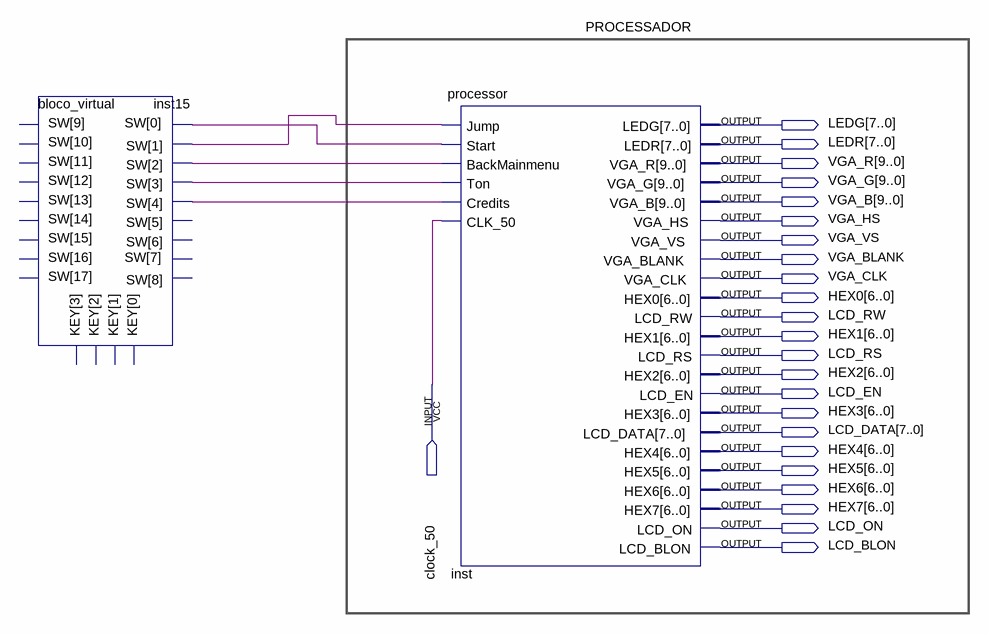
[diagram p0: schematic sheet]
// Quartus schematic projeto.bdf as structural Verilog: 2 symbols, 24 pins
module projeto (
  input  clock_50,
  output [7:0] LEDG,
  output [7:0] LEDR,
  output [9:0] VGA_R,
  output [9:0] VGA_G,
  output [9:0] VGA_B,
  output VGA_HS,
  output VGA_VS,
  output VGA_BLANK,
  output VGA_CLK,
  output [6:0] HEX0,
  output LCD_RW,
  output [6:0] HEX1,
  output LCD_RS,
  output [6:0] HEX2,
  output LCD_EN,
  output [6:0] HEX3,
  output [7:0] LCD_DATA,
  output [6:0] HEX4,
  output [6:0] HEX5,
  output [6:0] HEX6,
  output [6:0] HEX7,
  output LCD_ON,
  output LCD_BLON
);

  wire inst15_sw, inst15_sw_2, inst15_sw_3, inst15_sw_4, inst15_sw_5;
  wire [17:0] inst15_sw_open;  // unused outputs

  bloco_virtual inst15 (.SW({inst15_sw_open[17:5], inst15_sw_3, inst15_sw_2, inst15_sw, inst15_sw_5, inst15_sw_4}));  // open: KEY
  processor inst (
    .Jump(inst15_sw_5), .Start(inst15_sw_4), .BackMainmenu(inst15_sw), .Ton(inst15_sw_2),
    .Credits(inst15_sw_3), .CLK_50(clock_50), .LEDG(LEDG), .LEDR(LEDR), .VGA_R(VGA_R), .VGA_G(VGA_G),
    .VGA_B(VGA_B), .VGA_HS(VGA_HS), .VGA_VS(VGA_VS), .VGA_BLANK(VGA_BLANK), .VGA_CLK(VGA_CLK), .HEX0(HEX0),
    .LCD_RW(LCD_RW), .HEX1(HEX1), .LCD_RS(LCD_RS), .HEX2(HEX2), .LCD_EN(LCD_EN), .HEX3(HEX3),
    .LCD_DATA(LCD_DATA), .HEX4(HEX4), .HEX5(HEX5), .HEX6(HEX6), .HEX7(HEX7), .LCD_ON(LCD_ON),
    .LCD_BLON(LCD_BLON));

  // Notes on the sheet:
  //   PROCESSADOR
endmodule
